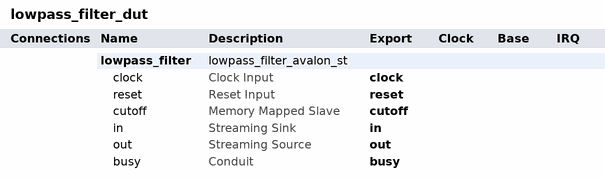
[diagram p0: system contents]
# Platform Designer (Qsys) system lowpass_filter_dut, Cyclone V 5CSXFC6C6U23C8ES
# Parameters at their usual value, and those the tool derives, are not listed.
package require qsys
create_system lowpass_filter_dut
set_project_property DEVICE_FAMILY {Cyclone V}
set_project_property DEVICE 5CSXFC6C6U23C8ES

add_instance lowpass_filter lowpass_filter_avalon_st 1.0
set_instance_parameter_value lowpass_filter WIDTH 8
set_instance_parameter_value lowpass_filter FORWARD_DELIMITERS 0
set_instance_parameter_value lowpass_filter EOP_ON_EXCEED 0
set_instance_parameter_value lowpass_filter NEW_EOP_VALUE 255

# exported interfaces
add_interface clock clock sink
set_interface_property clock EXPORT_OF lowpass_filter.clock
add_interface reset reset sink
set_interface_property reset EXPORT_OF lowpass_filter.reset
add_interface cutoff avalon slave
set_interface_property cutoff EXPORT_OF lowpass_filter.cutoff
add_interface in avalon_streaming sink
set_interface_property in EXPORT_OF lowpass_filter.in
add_interface out avalon_streaming source
set_interface_property out EXPORT_OF lowpass_filter.out
add_interface busy conduit end
set_interface_property busy EXPORT_OF lowpass_filter.busy

set_interconnect_requirement {$system} qsys_mm.clockCrossingAdapter HANDSHAKE
set_interconnect_requirement {$system} qsys_mm.maxAdditionalLatency 1
set_interconnect_requirement {$system} qsys_mm.insertDefaultSlave false

save_system lowpass_filter_dut.qsys
